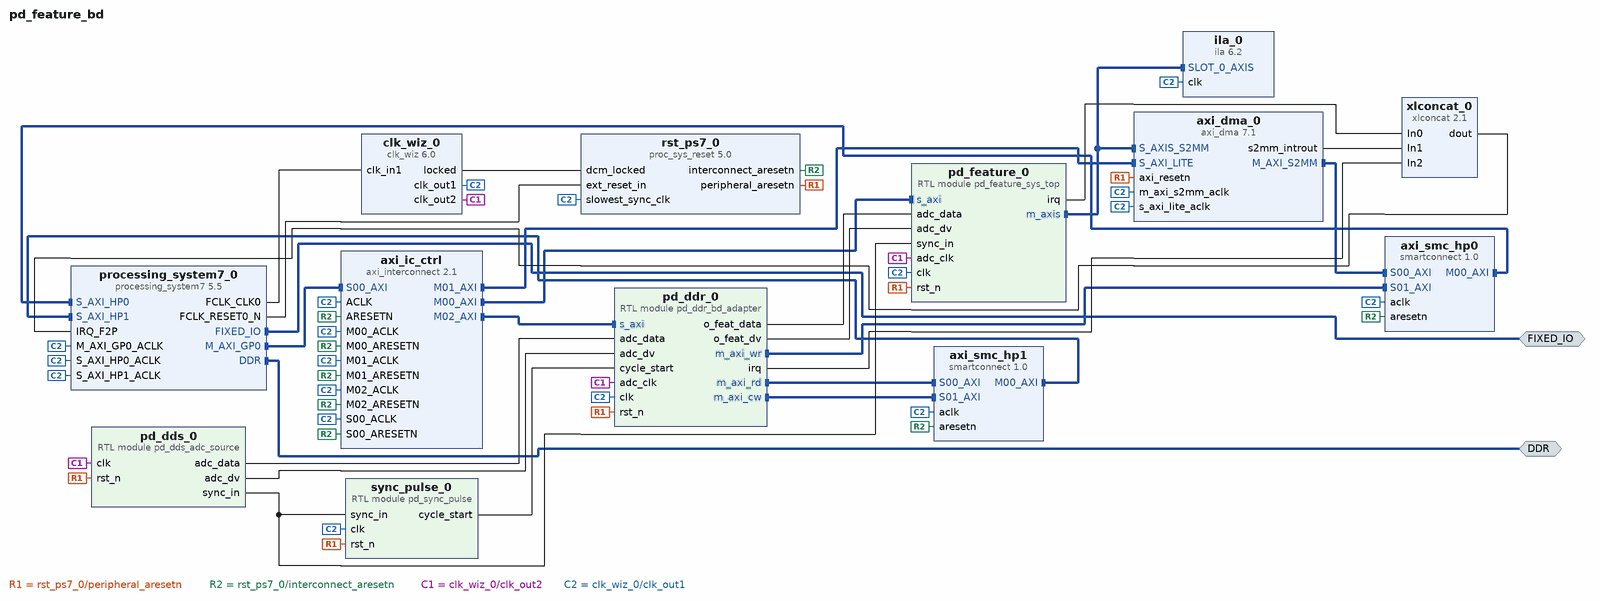
[diagram p0: block diagram of the top level]
# Vivado block design pd_feature_bd, xc7z020clg400-2, Vivado 2020.2
create_bd_design pd_feature_bd

create_bd_intf_port -mode Master -vlnv xilinx.com:interface:ddrx_rtl:1.0 DDR
create_bd_intf_port -mode Master -vlnv xilinx.com:display_processing_system7:fixedio_rtl:1.0 FIXED_IO

create_bd_cell -type ip -vlnv xilinx.com:ip:processing_system7:5.5 processing_system7_0
set_property -dict [list \
  CONFIG.PCW_APU_PERIPHERAL_FREQMHZ 666.666666 \
  CONFIG.PCW_CPU_CPU_6X4X_MAX_RANGE 767 \
  CONFIG.PCW_ENET0_PERIPHERAL_ENABLE 0 \
  CONFIG.PCW_FPGA0_PERIPHERAL_FREQMHZ 150 \
  CONFIG.PCW_FPGA1_PERIPHERAL_FREQMHZ 50 \
  CONFIG.PCW_GPIO_MIO_GPIO_ENABLE 0 \
  CONFIG.PCW_IRQ_F2P_INTR 1 \
  CONFIG.PCW_PERIPHERAL_BOARD_PRESET None \
  CONFIG.PCW_PRESET_BANK1_VOLTAGE {LVCMOS 3.3V} \
  CONFIG.PCW_QSPI_PERIPHERAL_ENABLE 0 \
  CONFIG.PCW_SD0_PERIPHERAL_ENABLE 0 \
  CONFIG.PCW_UART1_PERIPHERAL_ENABLE 0 \
  CONFIG.PCW_UIPARAM_DDR_BUS_WIDTH {16 Bit} \
  CONFIG.PCW_UIPARAM_DDR_FREQ_MHZ 533.333333 \
  CONFIG.PCW_UIPARAM_DDR_PARTNO {MT41K256M16 RE-125} \
  CONFIG.PCW_USB0_PERIPHERAL_ENABLE 0 \
  CONFIG.PCW_USE_FABRIC_INTERRUPT 1 \
  CONFIG.PCW_USE_S_AXI_HP0 1 \
  CONFIG.PCW_USE_S_AXI_HP1 1 \
  CONFIG.preset None \
] [get_bd_cells processing_system7_0]
# 334 more settings of processing_system7_0 are not shown: defaults, MIO pin electricals, DDR timing, and values the tool derives
create_bd_cell -type ip -vlnv xilinx.com:ip:clk_wiz:6.0 clk_wiz_0
set_property -dict [list \
  CONFIG.CLKOUT1_JITTER 161.914 \
  CONFIG.CLKOUT1_PHASE_ERROR 191.717 \
  CONFIG.CLKOUT1_REQUESTED_OUT_FREQ 130.000 \
  CONFIG.CLKOUT2_JITTER 214.017 \
  CONFIG.CLKOUT2_PHASE_ERROR 191.717 \
  CONFIG.CLKOUT2_USED true \
  CONFIG.MMCM_CLKFBOUT_MULT_F 39.000 \
  CONFIG.MMCM_CLKOUT0_DIVIDE_F 9.000 \
  CONFIG.MMCM_CLKOUT1_DIVIDE 45 \
  CONFIG.NUM_OUT_CLKS 2 \
  CONFIG.PRIM_IN_FREQ 150.000 \
  CONFIG.USE_LOCKED true \
  CONFIG.USE_RESET false \
] [get_bd_cells clk_wiz_0]
create_bd_cell -type ip -vlnv xilinx.com:ip:proc_sys_reset:5.0 rst_ps7_0
create_bd_cell -type ip -vlnv xilinx.com:ip:axi_interconnect:2.1 axi_ic_ctrl
set_property -dict {CONFIG.NUM_MI 3} [get_bd_cells axi_ic_ctrl]
create_bd_cell -type ip -vlnv xilinx.com:ip:axi_dma:7.1 axi_dma_0
set_property -dict [list \
  CONFIG.c_include_mm2s 0 \
  CONFIG.c_include_s2mm 1 \
  CONFIG.c_include_sg 0 \
  CONFIG.c_m_axi_s2mm_data_width 64 \
  CONFIG.c_sg_length_width 16 \
] [get_bd_cells axi_dma_0]
create_bd_cell -type ip -vlnv xilinx.com:ip:smartconnect:1.0 axi_smc_hp0
set_property -dict {CONFIG.NUM_MI 1 CONFIG.NUM_SI 2} [get_bd_cells axi_smc_hp0]
create_bd_cell -type ip -vlnv xilinx.com:ip:smartconnect:1.0 axi_smc_hp1
set_property -dict {CONFIG.NUM_MI 1 CONFIG.NUM_SI 2} [get_bd_cells axi_smc_hp1]
create_bd_cell -type ip -vlnv xilinx.com:ip:xlconcat:2.1 xlconcat_0
set_property -dict {CONFIG.NUM_PORTS 3} [get_bd_cells xlconcat_0]
create_bd_cell -type module -reference pd_feature_sys_top pd_feature_0
set_property -dict {CONFIG.INPUT_CDC 0 CONFIG.SAMPLE_HZ 26000000} [get_bd_cells pd_feature_0]
create_bd_cell -type module -reference pd_sync_pulse sync_pulse_0
create_bd_cell -type module -reference pd_ddr_bd_adapter pd_ddr_0
create_bd_cell -type module -reference pd_dds_adc_source pd_dds_0
create_bd_cell -type ip -vlnv xilinx.com:ip:ila:6.2 ila_0
set_property -dict {CONFIG.C_NUM_OF_PROBES 9 CONFIG.C_SLOT_0_AXI_PROTOCOL AXI4S} [get_bd_cells ila_0]

# ---- connections ----

connect_bd_intf_net [get_bd_intf_pins pd_ddr_0/m_axi_wr] [get_bd_intf_pins axi_smc_hp0/S01_AXI]
connect_bd_intf_net [get_bd_intf_pins axi_dma_0/M_AXI_S2MM] [get_bd_intf_pins axi_smc_hp0/S00_AXI]
connect_bd_intf_net [get_bd_intf_pins pd_ddr_0/m_axi_rd] [get_bd_intf_pins axi_smc_hp1/S00_AXI]
connect_bd_intf_net [get_bd_intf_pins axi_ic_ctrl/M02_AXI] [get_bd_intf_pins pd_ddr_0/s_axi]
connect_bd_intf_net [get_bd_intf_pins pd_ddr_0/m_axi_cw] [get_bd_intf_pins axi_smc_hp1/S01_AXI]
connect_bd_intf_net [get_bd_intf_pins axi_smc_hp0/M00_AXI] [get_bd_intf_pins processing_system7_0/S_AXI_HP0]
connect_bd_intf_net [get_bd_intf_pins processing_system7_0/M_AXI_GP0] [get_bd_intf_pins axi_ic_ctrl/S00_AXI]
connect_bd_intf_net [get_bd_intf_pins axi_ic_ctrl/M01_AXI] [get_bd_intf_pins axi_dma_0/S_AXI_LITE]
connect_bd_intf_net [get_bd_intf_ports FIXED_IO] [get_bd_intf_pins processing_system7_0/FIXED_IO]
connect_bd_intf_net [get_bd_intf_pins axi_smc_hp1/M00_AXI] [get_bd_intf_pins processing_system7_0/S_AXI_HP1]
connect_bd_intf_net [get_bd_intf_pins axi_ic_ctrl/M00_AXI] [get_bd_intf_pins pd_feature_0/s_axi]
connect_bd_intf_net [get_bd_intf_pins pd_feature_0/m_axis] [get_bd_intf_pins axi_dma_0/S_AXIS_S2MM]
connect_bd_intf_net [get_bd_intf_pins pd_feature_0/m_axis] [get_bd_intf_pins ila_0/SLOT_0_AXIS]
connect_bd_intf_net [get_bd_intf_ports DDR] [get_bd_intf_pins processing_system7_0/DDR]
connect_bd_net [get_bd_pins processing_system7_0/FCLK_CLK0] [get_bd_pins clk_wiz_0/clk_in1]
connect_bd_net [get_bd_pins processing_system7_0/FCLK_RESET0_N] [get_bd_pins rst_ps7_0/ext_reset_in]
connect_bd_net [get_bd_pins clk_wiz_0/locked] [get_bd_pins rst_ps7_0/dcm_locked]
connect_bd_net [get_bd_pins rst_ps7_0/peripheral_aresetn] \
  [get_bd_pins axi_dma_0/axi_resetn] [get_bd_pins pd_feature_0/rst_n] [get_bd_pins sync_pulse_0/rst_n] \
  [get_bd_pins pd_ddr_0/rst_n] [get_bd_pins pd_dds_0/rst_n]
connect_bd_net [get_bd_pins rst_ps7_0/interconnect_aresetn] \
  [get_bd_pins axi_ic_ctrl/ARESETN] [get_bd_pins axi_ic_ctrl/S00_ARESETN] [get_bd_pins axi_ic_ctrl/M00_ARESETN] \
  [get_bd_pins axi_ic_ctrl/M01_ARESETN] [get_bd_pins axi_ic_ctrl/M02_ARESETN] [get_bd_pins axi_smc_hp0/aresetn] \
  [get_bd_pins axi_smc_hp1/aresetn]
connect_bd_net [get_bd_pins pd_feature_0/irq] [get_bd_pins xlconcat_0/In0]
connect_bd_net [get_bd_pins axi_dma_0/s2mm_introut] [get_bd_pins xlconcat_0/In1]
connect_bd_net [get_bd_pins pd_ddr_0/irq] [get_bd_pins xlconcat_0/In2]
connect_bd_net [get_bd_pins xlconcat_0/dout] [get_bd_pins processing_system7_0/IRQ_F2P]
connect_bd_net [get_bd_pins pd_ddr_0/o_feat_data] [get_bd_pins pd_feature_0/adc_data]
connect_bd_net [get_bd_pins pd_ddr_0/o_feat_dv] [get_bd_pins pd_feature_0/adc_dv]
connect_bd_net [get_bd_pins sync_pulse_0/cycle_start] [get_bd_pins pd_ddr_0/cycle_start]
connect_bd_net [get_bd_pins pd_dds_0/adc_data] [get_bd_pins pd_ddr_0/adc_data]
connect_bd_net [get_bd_pins pd_dds_0/adc_dv] [get_bd_pins pd_ddr_0/adc_dv]
connect_bd_net [get_bd_pins pd_dds_0/sync_in] [get_bd_pins sync_pulse_0/sync_in] [get_bd_pins pd_feature_0/sync_in]
connect_bd_net [get_bd_pins clk_wiz_0/clk_out2] [get_bd_pins pd_dds_0/clk] [get_bd_pins pd_feature_0/adc_clk] [get_bd_pins pd_ddr_0/adc_clk]
connect_bd_net [get_bd_pins clk_wiz_0/clk_out1] \
  [get_bd_pins rst_ps7_0/slowest_sync_clk] [get_bd_pins axi_ic_ctrl/ACLK] [get_bd_pins axi_ic_ctrl/S00_ACLK] \
  [get_bd_pins axi_ic_ctrl/M00_ACLK] [get_bd_pins axi_ic_ctrl/M01_ACLK] [get_bd_pins axi_ic_ctrl/M02_ACLK] \
  [get_bd_pins pd_feature_0/clk] [get_bd_pins sync_pulse_0/clk] [get_bd_pins axi_dma_0/s_axi_lite_aclk] \
  [get_bd_pins axi_dma_0/m_axi_s2mm_aclk] [get_bd_pins pd_ddr_0/clk] [get_bd_pins axi_smc_hp1/aclk] \
  [get_bd_pins axi_smc_hp0/aclk] [get_bd_pins processing_system7_0/M_AXI_GP0_ACLK] \
  [get_bd_pins processing_system7_0/S_AXI_HP0_ACLK] [get_bd_pins processing_system7_0/S_AXI_HP1_ACLK] [get_bd_pins ila_0/clk]

# ---- address map ----
assign_bd_address -offset 0x00000000 -range 512M -target_address_space [get_bd_addr_spaces axi_dma_0/Data_S2MM] [get_bd_addr_segs processing_system7_0/S_AXI_HP0/HP0_DDR_LOWOCM]
assign_bd_address -offset 0x00000000 -range 512M -target_address_space [get_bd_addr_spaces pd_ddr_0/m_axi_cw] [get_bd_addr_segs processing_system7_0/S_AXI_HP1/HP1_DDR_LOWOCM]
assign_bd_address -offset 0x00000000 -range 512M -target_address_space [get_bd_addr_spaces pd_ddr_0/m_axi_rd] [get_bd_addr_segs processing_system7_0/S_AXI_HP1/HP1_DDR_LOWOCM]
assign_bd_address -offset 0x00000000 -range 512M -target_address_space [get_bd_addr_spaces pd_ddr_0/m_axi_wr] [get_bd_addr_segs processing_system7_0/S_AXI_HP0/HP0_DDR_LOWOCM]
assign_bd_address -offset 0x40000000 -range 64K -target_address_space [get_bd_addr_spaces processing_system7_0/Data] [get_bd_addr_segs pd_feature_0/s_axi/reg0]
assign_bd_address -offset 0x40010000 -range 64K -target_address_space [get_bd_addr_spaces processing_system7_0/Data] [get_bd_addr_segs pd_ddr_0/s_axi/reg0]
assign_bd_address -offset 0x40400000 -range 64K -target_address_space [get_bd_addr_spaces processing_system7_0/Data] [get_bd_addr_segs axi_dma_0/S_AXI_LITE/Reg]

validate_bd_design
save_bd_design
